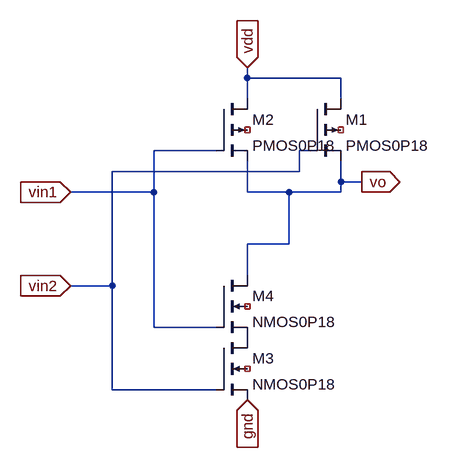
[diagram p0: schematic part2nand.asc]
part2nand.asc, the LTspice schematic file:
Version 4.1
SHEET 1 880 680
WIRE 160 -48 160 -64
WIRE 304 -48 160 -48
WIRE 160 -16 160 -48
WIRE 304 -16 304 -48
WIRE 112 64 16 64
WIRE 256 64 240 64
WIRE 240 96 240 64
WIRE 240 96 -48 96
WIRE 304 112 304 80
WIRE 336 112 304 112
WIRE 16 128 16 64
WIRE 16 128 -112 128
WIRE 160 128 160 80
WIRE 224 128 160 128
WIRE 304 128 304 112
WIRE 304 128 224 128
WIRE 224 208 224 128
WIRE 224 208 160 208
WIRE 160 256 160 208
WIRE -48 272 -48 96
WIRE -48 272 -112 272
WIRE 16 336 16 128
WIRE 112 336 16 336
WIRE -48 432 -48 272
WIRE 112 432 -48 432
FLAG -112 128 vin1
IOPIN -112 128 In
FLAG 336 112 vo
IOPIN 336 112 Out
FLAG 160 -64 vdd
IOPIN 160 -64 In
FLAG 160 448 gnd
IOPIN 160 448 In
FLAG -112 272 vin2
IOPIN -112 272 In
SYMBOL pmos4 112 -16 R0
SYMATTR InstName M2
SYMATTR Value PMOS0P18
SYMATTR Value2 l=0.18u w=1.8u
SYMBOL nmos4 112 352 R0
SYMATTR InstName M3
SYMATTR Value NMOS0P18
SYMATTR Value2 l=0.18u w=1.8u
SYMBOL nmos4 112 256 R0
SYMATTR InstName M4
SYMATTR Value NMOS0P18
SYMATTR Value2 l=0.18u w=1.8u
SYMBOL pmos4 256 -16 R0
SYMATTR InstName M1
SYMATTR Value PMOS0P18
SYMATTR Value2 l=0.18u w=1.8u

The netlist it stands for:
* part2nand.asc
M2 vdd vin1 vo NC_01 PMOS0P18 l=0.18u w=1.8u
M3 P001 vin2 gnd NC_02 NMOS0P18 l=0.18u w=1.8u
M4 vo vin1 P001 NC_03 NMOS0P18 l=0.18u w=1.8u
M1 vdd vin2 vo NC_04 PMOS0P18 l=0.18u w=1.8u
.model NMOS NMOS
.model PMOS PMOS
.lib standard.mos
.backanno
.end